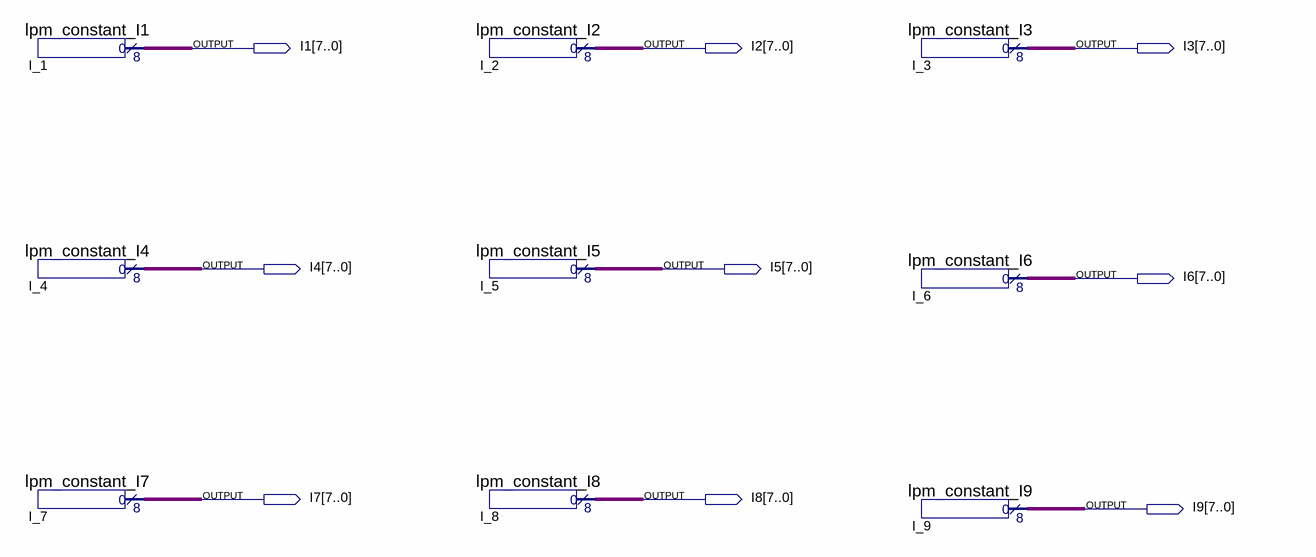
[diagram p0: schematic sheet]
// Quartus schematic I_Template.bdf as structural Verilog: 9 symbols, 9 pins
module I_Template (
  output [7:0] I1,
  output [7:0] I2,
  output [7:0] I3,
  output [7:0] I4,
  output [7:0] I5,
  output [7:0] I6,
  output [7:0] I7,
  output [7:0] I8,
  output [7:0] I9
);

  lpm_constant_I1 I_1 (.result(I1));
  lpm_constant_I4 I_4 (.result(I4));
  lpm_constant_I7 I_7 (.result(I7));
  lpm_constant_I2 I_2 (.result(I2));
  lpm_constant_I5 I_5 (.result(I5));
  lpm_constant_I8 I_8 (.result(I8));
  lpm_constant_I3 I_3 (.result(I3));
  lpm_constant_I6 I_6 (.result(I6));
  lpm_constant_I9 I_9 (.result(I9));
endmodule
